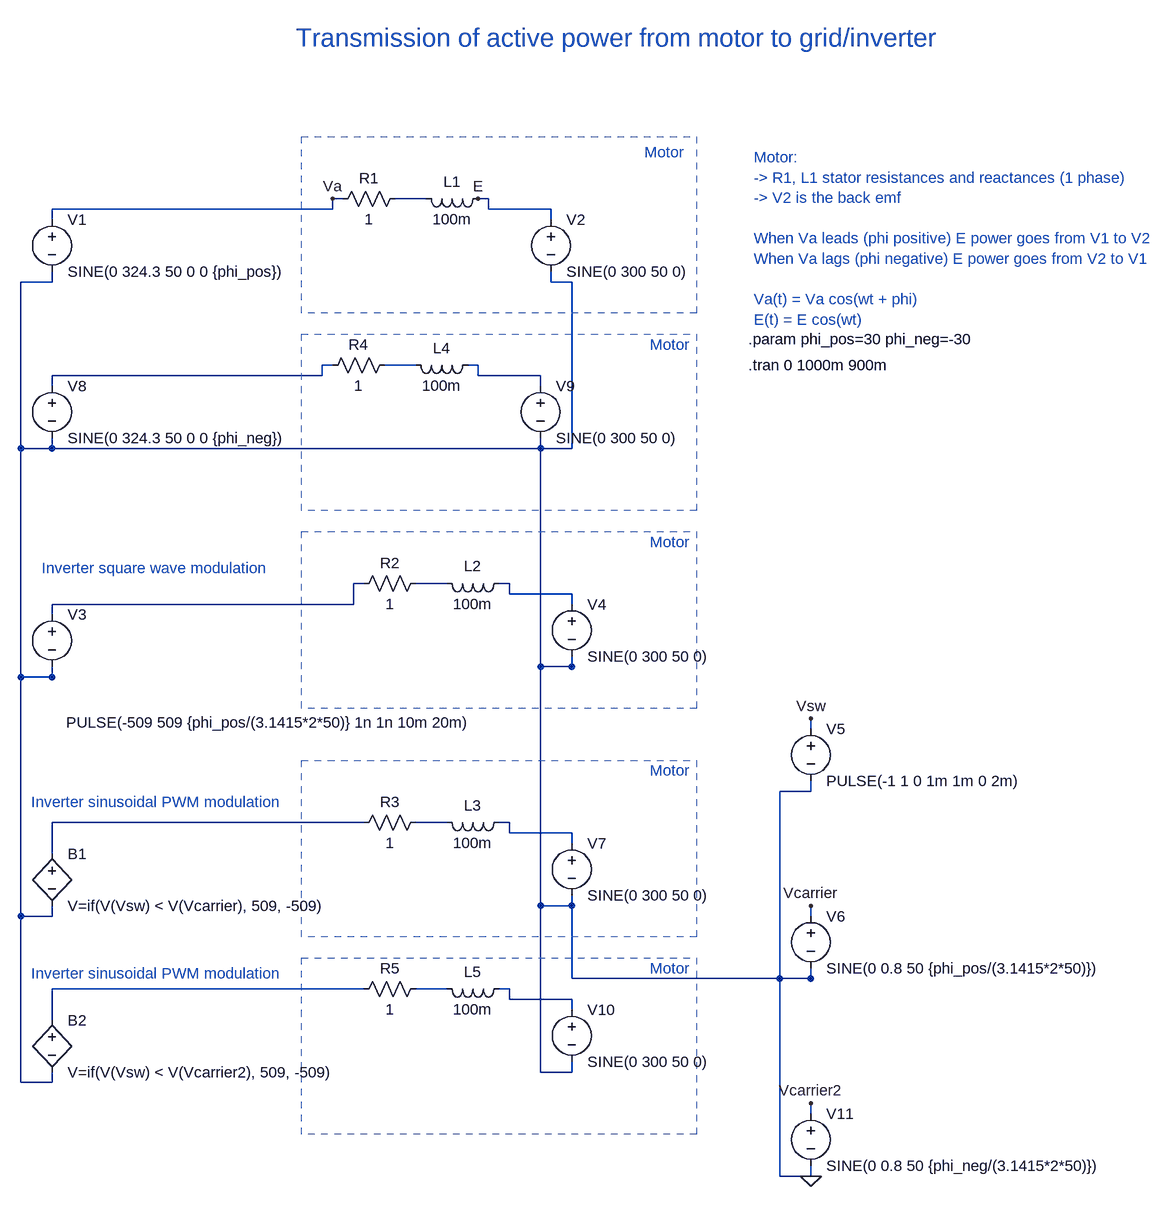
[diagram p0: schematic Power-line-power-transmission.asc]
Power-line-power-transmission.asc, the LTspice schematic file:
Version 4.1
SHEET 1 1524 1620
WIRE -464 880 -464 896
WIRE -464 1136 -464 1152
WIRE -464 -96 -464 -80
WIRE 336 1120 336 1136
WIRE 704 1280 704 1296
WIRE 304 -96 304 -80
WIRE -464 512 -464 528
WIRE 336 496 336 512
WIRE 704 688 704 704
WIRE 704 976 704 992
WIRE 336 864 336 880
WIRE -464 160 -464 176
WIRE 288 160 288 176
WIRE -464 896 -512 896
WIRE -512 896 -512 1152
WIRE -512 1152 -464 1152
WIRE -512 896 -512 528
WIRE -512 528 -464 528
WIRE -464 528 -512 528
WIRE -512 528 -512 176
WIRE -512 176 -464 176
WIRE -464 176 -512 176
WIRE -512 176 -512 -80
WIRE -512 -80 -464 -80
WIRE -464 176 288 176
WIRE 288 176 336 176
WIRE 336 176 336 -80
WIRE 336 -80 304 -80
WIRE 288 176 288 512
WIRE 288 512 336 512
WIRE 336 512 288 512
WIRE 288 512 288 880
WIRE 288 880 336 880
WIRE 336 880 288 880
WIRE 288 880 288 1136
WIRE 288 1136 336 1136
WIRE 336 880 336 992
WIRE 336 992 704 992
WIRE 704 992 656 992
WIRE 656 992 656 704
WIRE 656 704 704 704
WIRE 656 992 656 1296
WIRE 656 1296 704 1296
FLAG 704 1296 0
WIRE 192 -208 208 -208
WIRE 304 -176 304 -192
WIRE 208 -208 208 -192
WIRE 208 -192 304 -192
FLAG 192 -208 E
WIRE 112 -208 96 -208
WIRE 64 -208 80 -208
WIRE 96 -208 80 -208
WIRE -32 48 -48 48
WIRE -464 80 -464 64
WIRE -48 48 -48 64
WIRE -48 64 -464 64
WIRE 96 48 80 48
WIRE 48 48 64 48
WIRE 80 48 64 48
WIRE 176 48 192 48
WIRE 288 80 288 64
WIRE 192 48 192 64
WIRE 192 64 288 64
WIRE 16 384 0 384
WIRE -464 432 -464 416
WIRE 0 384 0 416
WIRE 0 416 -464 416
WIRE 144 384 128 384
WIRE 96 384 112 384
WIRE 128 384 112 384
WIRE 224 384 240 384
WIRE 336 416 336 400
WIRE 240 384 240 400
WIRE 240 400 336 400
WIRE -464 800 -464 784
WIRE 16 752 0 752
WIRE -464 784 -464 752
WIRE -464 752 0 752
WIRE 144 752 128 752
WIRE 96 752 112 752
WIRE 128 752 112 752
WIRE 224 752 240 752
WIRE 336 784 336 768
WIRE 240 752 240 768
WIRE 240 768 336 768
WIRE -464 1056 -464 1040
WIRE 16 1008 0 1008
WIRE -464 1040 -464 1008
WIRE -464 1008 0 1008
WIRE 144 1008 128 1008
WIRE 96 1008 112 1008
WIRE 128 1008 112 1008
WIRE 224 1008 240 1008
WIRE 336 1040 336 1024
WIRE 240 1008 240 1024
WIRE 240 1024 336 1024
WIRE -16 -208 -32 -208
WIRE -464 -176 -464 -192
WIRE -32 -208 -32 -192
WIRE -32 -192 -464 -192
FLAG -32 -208 Va
WIRE 704 896 704 880
FLAG 704 880 Vcarrier
WIRE 704 1200 704 1184
FLAG 704 1184 Vcarrier2
WIRE 704 608 704 592
FLAG 704 592 Vsw
SYMBOL voltage -464 -192 R0
WINDOW 123 0 0 Left 0
WINDOW 39 0 0 Left 0
SYMATTR InstName V1
SYMATTR Value SINE(0 324.3 50 0 0 {phi_pos})
SYMBOL ind 208 -224 R90
WINDOW 0 5 56 VBottom 2
WINDOW 3 32 56 VTop 2
SYMATTR InstName L1
SYMATTR Value 100m
SYMBOL voltage 304 -192 R0
WINDOW 123 0 0 Left 0
WINDOW 39 0 0 Left 0
SYMATTR InstName V2
SYMATTR Value SINE(0 300 50 0)
SYMBOL res 80 -224 R90
WINDOW 0 0 56 VBottom 2
WINDOW 3 32 56 VTop 2
SYMATTR InstName R1
SYMATTR Value 1
SYMBOL voltage -464 416 R0
WINDOW 3 22 182 Left 2
WINDOW 123 0 0 Left 0
WINDOW 39 0 0 Left 0
SYMATTR Value PULSE(-509 509 {phi_pos/(3.1415*2*50)} 1n 1n 10m 20m)
SYMATTR InstName V3
SYMBOL ind 240 368 R90
WINDOW 0 5 56 VBottom 2
WINDOW 3 32 56 VTop 2
SYMATTR InstName L2
SYMATTR Value 100m
SYMBOL voltage 336 400 R0
WINDOW 123 0 0 Left 0
WINDOW 39 0 0 Left 0
SYMATTR InstName V4
SYMATTR Value SINE(0 300 50 0)
SYMBOL res 112 368 R90
WINDOW 0 0 56 VBottom 2
WINDOW 3 32 56 VTop 2
SYMATTR InstName R2
SYMATTR Value 1
SYMBOL voltage 704 592 R0
WINDOW 123 0 0 Left 0
WINDOW 39 0 0 Left 0
SYMATTR InstName V5
SYMATTR Value PULSE(-1 1 0 1m 1m 0 2m)
SYMBOL voltage 704 880 R0
WINDOW 123 0 0 Left 0
WINDOW 39 0 0 Left 0
SYMATTR InstName V6
SYMATTR Value SINE(0 0.8 50 {phi_pos/(3.1415*2*50)})
SYMBOL bv -464 784 R0
SYMATTR InstName B1
SYMATTR Value V=if(V(Vsw) < V(Vcarrier), 509, -509)
SYMBOL ind 240 736 R90
WINDOW 0 5 56 VBottom 2
WINDOW 3 32 56 VTop 2
SYMATTR InstName L3
SYMATTR Value 100m
SYMBOL voltage 336 768 R0
WINDOW 123 0 0 Left 0
WINDOW 39 0 0 Left 0
SYMATTR InstName V7
SYMATTR Value SINE(0 300 50 0)
SYMBOL res 112 736 R90
WINDOW 0 0 56 VBottom 2
WINDOW 3 32 56 VTop 2
SYMATTR InstName R3
SYMATTR Value 1
SYMBOL voltage -464 64 R0
WINDOW 123 0 0 Left 0
WINDOW 39 0 0 Left 0
SYMATTR InstName V8
SYMATTR Value SINE(0 324.3 50 0 0 {phi_neg})
SYMBOL ind 192 32 R90
WINDOW 0 5 56 VBottom 2
WINDOW 3 32 56 VTop 2
SYMATTR InstName L4
SYMATTR Value 100m
SYMBOL voltage 288 64 R0
WINDOW 123 0 0 Left 0
WINDOW 39 0 0 Left 0
SYMATTR InstName V9
SYMATTR Value SINE(0 300 50 0)
SYMBOL res 64 32 R90
WINDOW 0 0 56 VBottom 2
WINDOW 3 32 56 VTop 2
SYMATTR InstName R4
SYMATTR Value 1
SYMBOL bv -464 1040 R0
SYMATTR InstName B2
SYMATTR Value V=if(V(Vsw) < V(Vcarrier2), 509, -509)
SYMBOL ind 240 992 R90
WINDOW 0 5 56 VBottom 2
WINDOW 3 32 56 VTop 2
SYMATTR InstName L5
SYMATTR Value 100m
SYMBOL voltage 336 1024 R0
WINDOW 123 0 0 Left 0
WINDOW 39 0 0 Left 0
SYMATTR InstName V10
SYMATTR Value SINE(0 300 50 0)
SYMBOL res 112 992 R90
WINDOW 0 0 56 VBottom 2
WINDOW 3 32 56 VTop 2
SYMATTR InstName R5
SYMATTR Value 1
SYMBOL voltage 704 1184 R0
WINDOW 123 0 0 Left 0
WINDOW 39 0 0 Left 0
SYMATTR InstName V11
SYMATTR Value SINE(0 0.8 50 {phi_neg/(3.1415*2*50)})
TEXT 608 48 Left 2 !.tran 0 1000m 900m
TEXT 608 8 Left 2 !.param phi_pos=30 phi_neg=-30
TEXT -480 360 Left 2 ;Inverter square wave modulation
TEXT -88 -456 Left 4 ;Transmission of active power from motor to grid/inverter
TEXT 616 -272 Left 2 ;Motor: \n-> R1, L1 stator resistances and reactances (1 phase)\n-> V2 is the back emf\n \nWhen Va leads (phi positive) E power goes from V1 to V2\nWhen Va lags (phi negative) E power goes from V2 to V1\n \nVa(t) = Va cos(wt + phi)\nE(t) = E cos(wt)
TEXT 448 -280 Left 2 ;Motor
TEXT 456 16 Left 2 ;Motor
TEXT 456 320 Left 2 ;Motor
TEXT 456 672 Left 2 ;Motor
TEXT 456 976 Left 2 ;Motor
TEXT -496 720 Left 2 ;Inverter sinusoidal PWM modulation
TEXT -496 984 Left 2 ;Inverter sinusoidal PWM modulation
RECTANGLE Normal 528 -32 -80 -304 2
RECTANGLE Normal 528 272 -80 0 2
RECTANGLE Normal 528 576 -80 304 2
RECTANGLE Normal 528 928 -80 656 2
RECTANGLE Normal 528 1232 -80 960 2

The netlist it stands for:
* Power-line-power-transmission.asc
V1 Va 0 SINE(0 324.3 50 0 0 {phi_pos})
L1 E N001 100m
V2 E 0 SINE(0 300 50 0)
R1 N001 Va 1
V3 N005 0 PULSE(-509 509 {phi_pos/(3.1415*2*50)} 1n 1n 10m 20m)
L2 N007 N006 100m
V4 N007 0 SINE(0 300 50 0)
R2 N006 N005 1
V5 Vsw 0 PULSE(-1 1 0 1m 1m 0 2m)
V6 Vcarrier 0 SINE(0 0.8 50 {phi_pos/(3.1415*2*50)})
B1 N008 0 V=if(V(Vsw) < V(Vcarrier), 509, -509)
L3 N010 N009 100m
V7 N010 0 SINE(0 300 50 0)
R3 N009 N008 1
V8 N002 0 SINE(0 324.3 50 0 0 {phi_neg})
L4 N004 N003 100m
V9 N004 0 SINE(0 300 50 0)
R4 N003 N002 1
B2 N011 0 V=if(V(Vsw) < V(Vcarrier2), 509, -509)
L5 N013 N012 100m
V10 N013 0 SINE(0 300 50 0)
R5 N012 N011 1
V11 Vcarrier2 0 SINE(0 0.8 50 {phi_neg/(3.1415*2*50)})
.tran 0 1000m 900m
.param phi_pos=30 phi_neg=-30
* Inverter square wave modulation
* Transmission of active power from motor to grid/inverter
* Motor:
* -> R1, L1 stator resistances and reactances (1 phase)
* -> V2 is the back emf
* When Va leads (phi positive) E power goes from V1 to V2
* When Va lags (phi negative) E power goes from V2 to V1
* Va(t) = Va cos(wt + phi)
* E(t) = E cos(wt)
* Motor
* Motor
* Motor
* Motor
* Motor
* Inverter sinusoidal PWM modulation
* Inverter sinusoidal PWM modulation
.backanno
.end